# Altium schematic sheet RK3399_MPI_GPIO_I2C.SchDoc
size A4; SheetNumber: 10; SheetTotal: 20
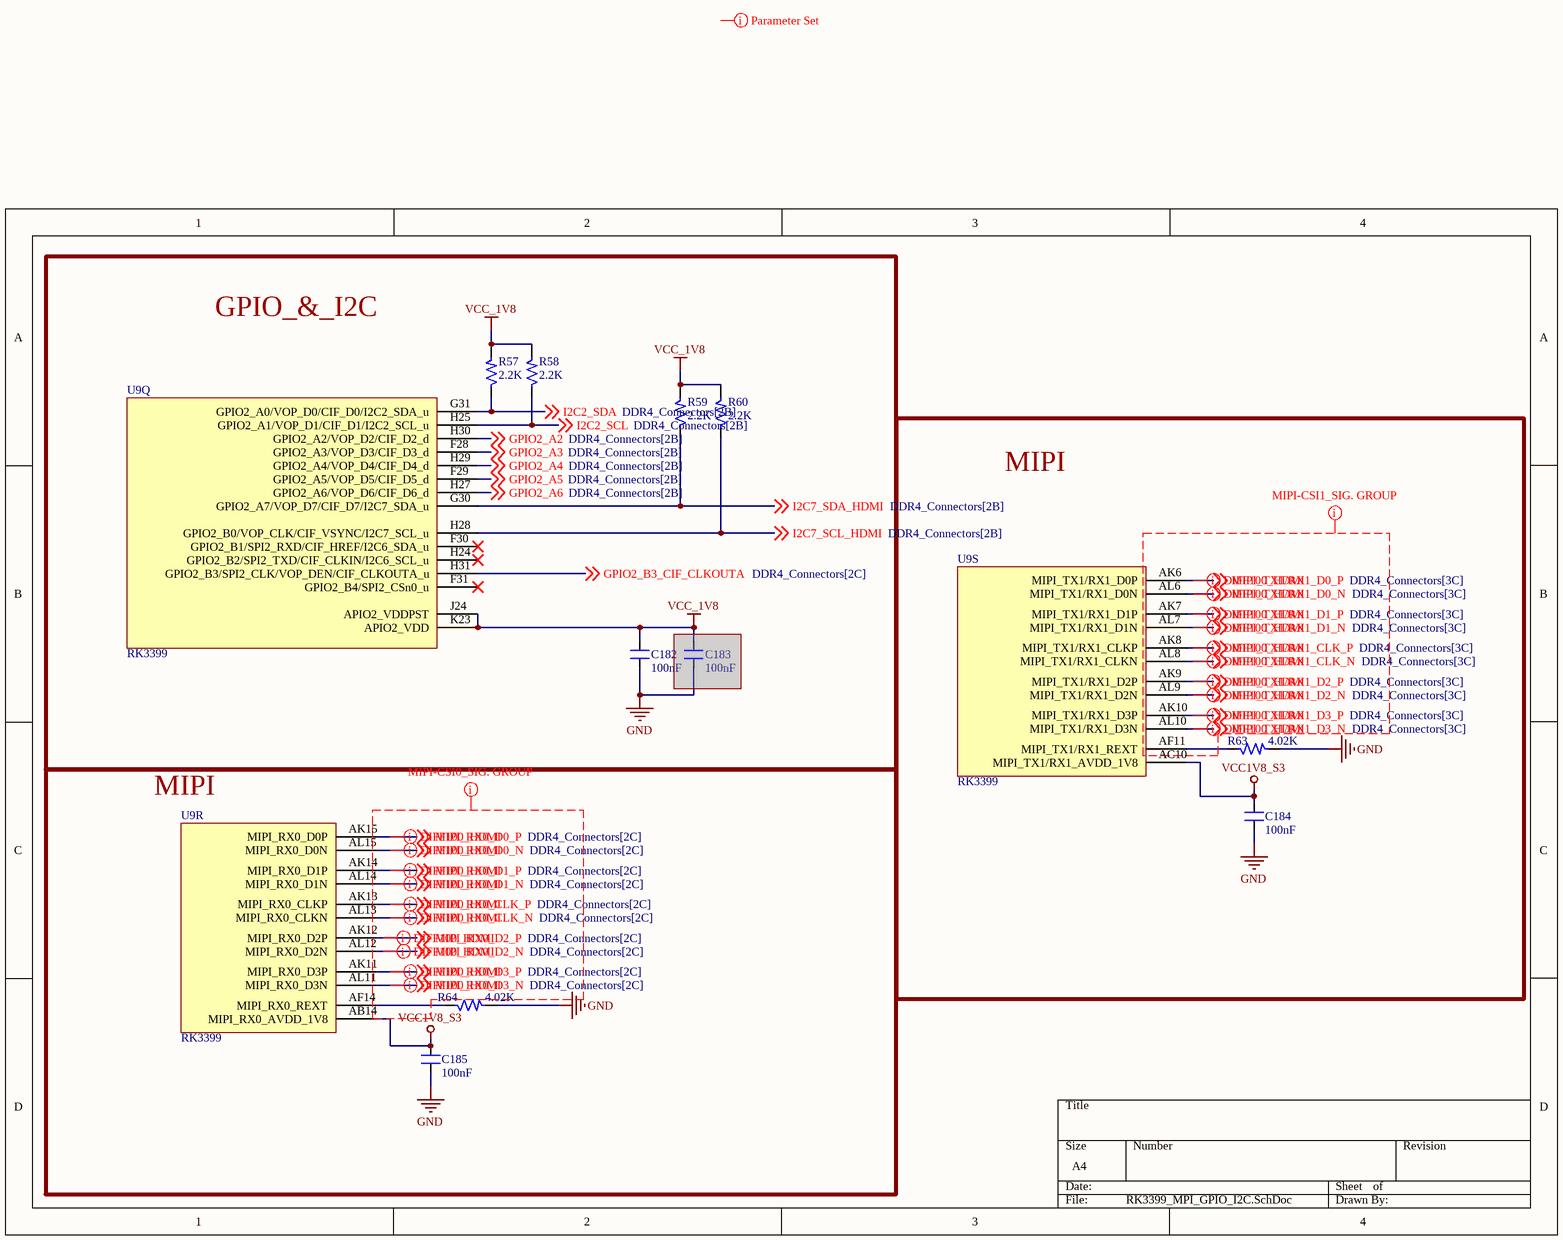
[diagram p0: RK3399_MPI_GPIO_I2C.SchDoc]

## Parts
C182  100nF  [CAP_0201]
C183  100nF  [CAP_0201]  (masked out: inside a compile mask, not in the netlist)
C184  100nF  [CAP_0201]
C185  100nF  [CAP_0201]
R57  2.2K  [RES_0201]
R58  2.2K  [RES_0201]
R59  2.2K  [RES_0201]
R60  2.2K  [RES_0201]
R63  4.02K  [RES_0201]
R64  4.02K  [RES_0201]
U9  RK3399  [FBGA828_23_826X826]  (parts Q,R,S of 24)

## Blocks framed on the sheet
GPIO_&_I2C: C182 C183 R57-R60 U9
MIPI: C184 R63 U9
MIPI: C185 R64 U9

## Nets
GND: C182.1 C184.1 C185.1 R63.2 R64.2
VCC1V8_S3: C184.2 C185.2 U9.AB14(MIPI_RX0_AVDD_1V8) U9.AC10(MIPI_TX1/RX1_AVDD_1V8)
VCC_1V8: C182.2 R57.2 R58.2 R59.2 R60.2 U9.J24(APIO2_VDDPST) U9.K23(APIO2_VDD)
GPIO2_A2: U9.H30(GPIO2_A2/VOP_D2/CIF_D2_d) ; off-sheet GPIO2_A2
GPIO2_A3: U9.F28(GPIO2_A3/VOP_D3/CIF_D3_d) ; off-sheet GPIO2_A3
GPIO2_A4: U9.H29(GPIO2_A4/VOP_D4/CIF_D4_d) ; off-sheet GPIO2_A4
GPIO2_A5: U9.F29(GPIO2_A5/VOP_D5/CIF_D5_d) ; off-sheet GPIO2_A5
GPIO2_A6: U9.H27(GPIO2_A6/VOP_D6/CIF_D6_d) ; off-sheet GPIO2_A6
GPIO2_B3_CIF_CLKOUTA: U9.H31(GPIO2_B3/SPI2_CLK/VOP_DEN/CIF_CLKOUTA_u) ; off-sheet GPIO2_B3_CIF_CLKOUTA
I2C2_SCL: R58.1 U9.H25(GPIO2_A1/VOP_D1/CIF_D1/I2C2_SCL_u) ; off-sheet I2C2_SCL
I2C2_SDA: R57.1 U9.G31(GPIO2_A0/VOP_D0/CIF_D0/I2C2_SDA_u) ; off-sheet I2C2_SDA
I2C7_SCL_HDMI: R60.1 U9.H28(GPIO2_B0/VOP_CLK/CIF_VSYNC/I2C7_SCL_u) ; off-sheet I2C7_SCL_HDMI
I2C7_SDA_HDMI: R59.1 U9.G30(GPIO2_A7/VOP_D7/CIF_D7/I2C7_SDA_u) ; off-sheet I2C7_SDA_HDMI
MIPI_RX0_CLK_N: U9.AL13(MIPI_RX0_CLKN) ; off-sheet MIPI_RX0_CLK_N
MIPI_RX0_CLK_P: U9.AK13(MIPI_RX0_CLKP) ; off-sheet MIPI_RX0_CLK_P
MIPI_RX0_D0_N: U9.AL15(MIPI_RX0_D0N) ; off-sheet MIPI_RX0_D0_N
MIPI_RX0_D0_P: U9.AK15(MIPI_RX0_D0P) ; off-sheet MIPI_RX0_D0_P
MIPI_RX0_D1_N: U9.AL14(MIPI_RX0_D1N) ; off-sheet MIPI_RX0_D1_N
MIPI_RX0_D1_P: U9.AK14(MIPI_RX0_D1P) ; off-sheet MIPI_RX0_D1_P
MIPI_RX0_D2_N: U9.AL12(MIPI_RX0_D2N) ; off-sheet MIPI_RX0_D2_N
MIPI_RX0_D2_P: U9.AK12(MIPI_RX0_D2P) ; off-sheet MIPI_RX0_D2_P
MIPI_RX0_D3_N: U9.AL11(MIPI_RX0_D3N) ; off-sheet MIPI_RX0_D3_N
MIPI_RX0_D3_P: U9.AK11(MIPI_RX0_D3P) ; off-sheet MIPI_RX0_D3_P
MIPI_TX1/RX1_CLK_N: U9.AL8(MIPI_TX1/RX1_CLKN) ; off-sheet MIPI_TX1/RX1_CLK_N
MIPI_TX1/RX1_CLK_P: U9.AK8(MIPI_TX1/RX1_CLKP) ; off-sheet MIPI_TX1/RX1_CLK_P
MIPI_TX1/RX1_D0_N: U9.AL6(MIPI_TX1/RX1_D0N) ; off-sheet MIPI_TX1/RX1_D0_N
MIPI_TX1/RX1_D0_P: U9.AK6(MIPI_TX1/RX1_D0P) ; off-sheet MIPI_TX1/RX1_D0_P
MIPI_TX1/RX1_D1_N: U9.AL7(MIPI_TX1/RX1_D1N) ; off-sheet MIPI_TX1/RX1_D1_N
MIPI_TX1/RX1_D1_P: U9.AK7(MIPI_TX1/RX1_D1P) ; off-sheet MIPI_TX1/RX1_D1_P
MIPI_TX1/RX1_D2_N: U9.AL9(MIPI_TX1/RX1_D2N) ; off-sheet MIPI_TX1/RX1_D2_N
MIPI_TX1/RX1_D2_P: U9.AK9(MIPI_TX1/RX1_D2P) ; off-sheet MIPI_TX1/RX1_D2_P
MIPI_TX1/RX1_D3_N: U9.AL10(MIPI_TX1/RX1_D3N) ; off-sheet MIPI_TX1/RX1_D3_N
MIPI_TX1/RX1_D3_P: U9.AK10(MIPI_TX1/RX1_D3P) ; off-sheet MIPI_TX1/RX1_D3_P
NetR63_1: R63.1 U9.AF11(MIPI_TX1/RX1_REXT)
NetR64_1: R64.1 U9.AF14(MIPI_RX0_REXT)

Not connected (* = marked no-connect by the designer): U9 F30(GPIO2_B1/SPI2_RXD/CIF_HREF/I2C6_SDA_u)* F31(GPIO2_B4/SPI2_CSn0_u)* H24(GPIO2_B2/SPI2_TXD/CIF_CLKIN/I2C6_SCL_u)*

## Layout directives
net class MIPI-CSI0_SIG. GROUP: MIPI_RX0_CLK_N, MIPI_RX0_CLK_P, MIPI_RX0_D0_N, MIPI_RX0_D0_P, MIPI_RX0_D1_N, MIPI_RX0_D1_P, MIPI_RX0_D2_N, MIPI_RX0_D2_P, MIPI_RX0_D3_N, MIPI_RX0_D3_P
net class MIPI-CSI1_SIG. GROUP: MIPI_TX1/RX1_CLK_N, MIPI_TX1/RX1_CLK_P, MIPI_TX1/RX1_D0_N, MIPI_TX1/RX1_D0_P, MIPI_TX1/RX1_D1_N, MIPI_TX1/RX1_D1_P, MIPI_TX1/RX1_D2_N, MIPI_TX1/RX1_D2_P, MIPI_TX1/RX1_D3_N, MIPI_TX1/RX1_D3_P
differential pair; differential pair class DIFF100_HDMI: MIPI_RX0_CLK_N, MIPI_RX0_CLK_P, MIPI_RX0_D0_N, MIPI_RX0_D0_P, MIPI_RX0_D1_N, MIPI_RX0_D1_P, MIPI_RX0_D2_N, MIPI_RX0_D2_P, MIPI_RX0_D3_N, MIPI_RX0_D3_P, MIPI_TX1/RX1_CLK_N, MIPI_TX1/RX1_CLK_P, MIPI_TX1/RX1_D0_N, MIPI_TX1/RX1_D0_P, MIPI_TX1/RX1_D1_N, MIPI_TX1/RX1_D1_P, MIPI_TX1/RX1_D2_N, MIPI_TX1/RX1_D2_P, MIPI_TX1/RX1_D3_N, MIPI_TX1/RX1_D3_P

## Library data of the parts
C182-C185 = CAP_100nF-25V-10%-0201: 0.1µF ±10% 25V Ceramic Capacitor X5R 0201 (0603 Metric); Manufacturer: TDK Corporation; Manufacturer Part Number: C0603X5R1E104K030BB; Case/Package: 0201; Supplier-1: Digikey
R57-R60 = RES_2.2K-0.05W-1%-0201: 2.2 kOhms ±1% 0.05W, 1/20W Chip Resistor 0201 (0603 Metric) Thick Film; Manufacturer: Stackpole Electronics Inc; Manufacturer Part Number: RMCF0201FT2K20; Case/Package: 0201; Supplier-1: Digikey
R63 R64 = RES_4.02K-0.05W-1%-0201: 4.02 kOhms ±1% 0.05W, 1/20W Chip Resistor 0201 (0603 Metric) Thick Film; Manufacturer: Yageo; Manufacturer Part Number: RC0201FR-074K02L; Case/Package: 0201; Supplier-1: Digikey
U9 = IC_RK3399-FCBGA828: RK3399 is a low power, high performance processor for computing, personal mobile.; Manufacturer: Rockchip; Manufacturer Part Number: RK3399; Case/Package: FCBGA828; Supplier-1: Rockchip